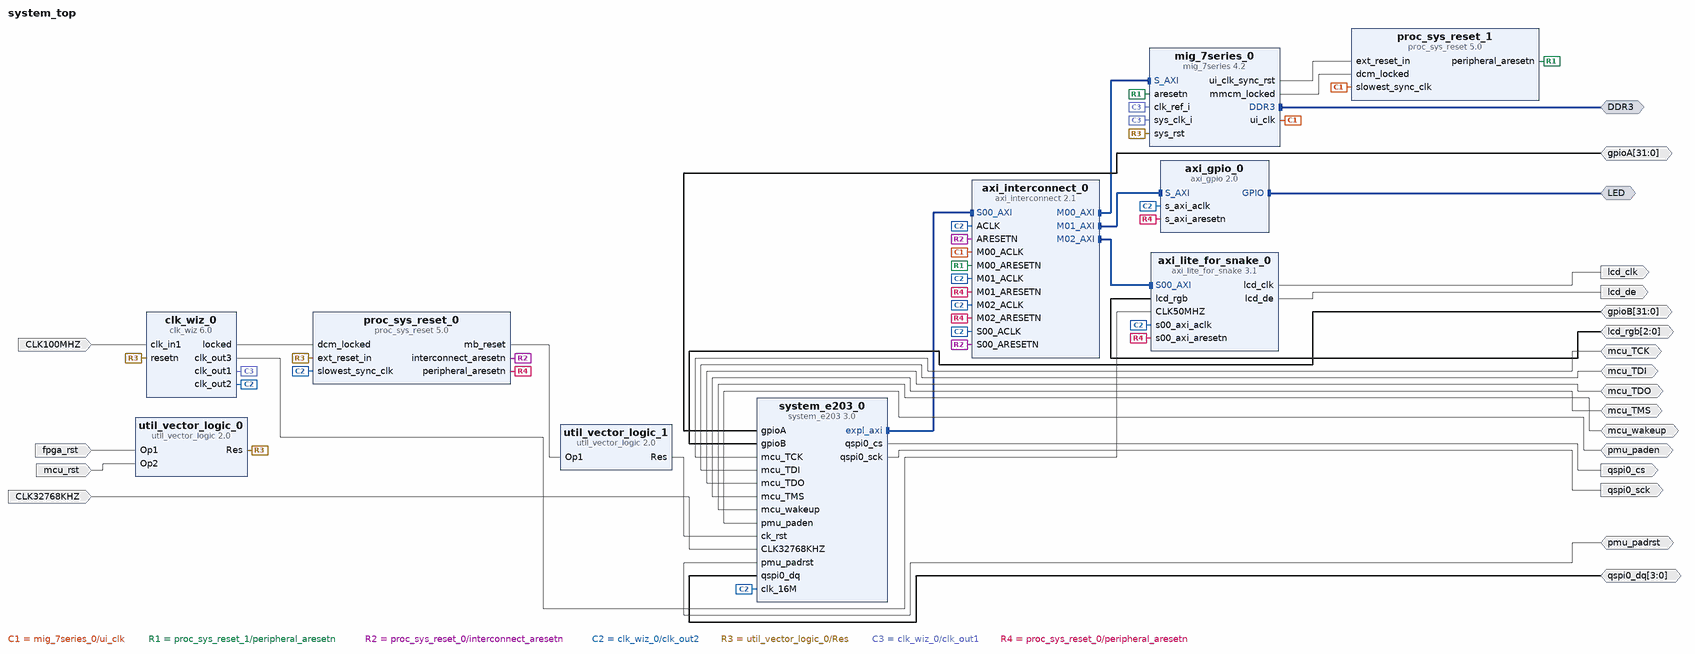
[diagram p0: block diagram of the top level]
# Vivado block design system_top, xc7a200tfbg484-2, Vivado 2020.2
create_bd_design system_top

create_bd_intf_port -mode Master -vlnv xilinx.com:interface:ddrx_rtl:1.0 DDR3
create_bd_intf_port -mode Master -vlnv xilinx.com:interface:gpio_rtl:1.0 LED
create_bd_port -dir I -type clk CLK100MHZ
create_bd_port -dir I -type rst fpga_rst
create_bd_port -dir I CLK32768KHZ
create_bd_port -dir I -type rst mcu_rst
create_bd_port -dir IO -from 31 -to 0 gpioA
create_bd_port -dir IO -from 31 -to 0 gpioB
create_bd_port -dir IO mcu_TCK
create_bd_port -dir IO mcu_TDI
create_bd_port -dir IO mcu_TDO
create_bd_port -dir IO mcu_TMS
create_bd_port -dir IO mcu_wakeup
create_bd_port -dir IO pmu_paden
create_bd_port -dir IO pmu_padrst
create_bd_port -dir O qspi0_cs
create_bd_port -dir IO -from 3 -to 0 qspi0_dq
create_bd_port -dir O qspi0_sck
create_bd_port -dir O lcd_de
create_bd_port -dir IO -from 2 -to 0 lcd_rgb
create_bd_port -dir O -type clk lcd_clk

create_bd_cell -type ip -vlnv xilinx.com:ip:axi_interconnect:2.1 axi_interconnect_0
set_property -dict {CONFIG.ENABLE_ADVANCED_OPTIONS 0 CONFIG.NUM_MI 3} [get_bd_cells axi_interconnect_0]
create_bd_cell -type ip -vlnv xilinx.com:ip:clk_wiz:6.0 clk_wiz_0
set_property -dict [list \
  CONFIG.CLKOUT1_JITTER 126.455 \
  CONFIG.CLKOUT1_PHASE_ERROR 114.212 \
  CONFIG.CLKOUT1_REQUESTED_OUT_FREQ 200.000 \
  CONFIG.CLKOUT2_JITTER 209.277 \
  CONFIG.CLKOUT2_PHASE_ERROR 114.212 \
  CONFIG.CLKOUT2_REQUESTED_OUT_FREQ 16.000 \
  CONFIG.CLKOUT2_USED true \
  CONFIG.CLKOUT3_JITTER 167.017 \
  CONFIG.CLKOUT3_PHASE_ERROR 114.212 \
  CONFIG.CLKOUT3_REQUESTED_OUT_FREQ 50 \
  CONFIG.CLKOUT3_USED true \
  CONFIG.MMCM_CLKFBOUT_MULT_F 8.000 \
  CONFIG.MMCM_CLKOUT0_DIVIDE_F 4.000 \
  CONFIG.MMCM_CLKOUT1_DIVIDE 50 \
  CONFIG.MMCM_CLKOUT2_DIVIDE 16 \
  CONFIG.NUM_OUT_CLKS 3 \
  CONFIG.RESET_PORT resetn \
  CONFIG.RESET_TYPE ACTIVE_LOW \
] [get_bd_cells clk_wiz_0]
create_bd_cell -type ip -vlnv xilinx.com:ip:proc_sys_reset:5.0 proc_sys_reset_1
create_bd_cell -type ip -vlnv xilinx.com:ip:proc_sys_reset:5.0 proc_sys_reset_0
create_bd_cell -type ip -vlnv xilinx.com:ip:util_vector_logic:2.0 util_vector_logic_0
set_property -dict {CONFIG.C_SIZE 1} [get_bd_cells util_vector_logic_0]
create_bd_cell -type ip -vlnv xilinx.com:ip:mig_7series:4.2 mig_7series_0
set_property -dict [list \
  CONFIG.BOARD_MIG_PARAM Custom \
  CONFIG.MIG_DONT_TOUCH_PARAM Custom \
  CONFIG.RESET_BOARD_INTERFACE Custom \
  CONFIG.XML_INPUT_FILE mig_a.prj \
] [get_bd_cells mig_7series_0]
create_bd_cell -type ip -vlnv xilinx.com:ip:util_vector_logic:2.0 util_vector_logic_1
set_property -dict {CONFIG.C_OPERATION not CONFIG.C_SIZE 1} [get_bd_cells util_vector_logic_1]
create_bd_cell -type ip -vlnv xilinx.com:ip:axi_gpio:2.0 axi_gpio_0
set_property -dict {CONFIG.C_ALL_OUTPUTS 1 CONFIG.C_GPIO_WIDTH 2 CONFIG.C_IS_DUAL 0} [get_bd_cells axi_gpio_0]
create_bd_cell -type ip -vlnv xilinx.com:user:system_e203:3.0 system_e203_0
create_bd_cell -type ip -vlnv xilinx.com:user:axi_lite_for_snake:3.1 axi_lite_for_snake_0

# ---- connections ----

connect_bd_intf_net [get_bd_intf_ports DDR3] [get_bd_intf_pins mig_7series_0/DDR3]
connect_bd_intf_net [get_bd_intf_pins axi_interconnect_0/M02_AXI] [get_bd_intf_pins axi_lite_for_snake_0/S00_AXI]
connect_bd_intf_net [get_bd_intf_pins axi_interconnect_0/M01_AXI] [get_bd_intf_pins axi_gpio_0/S_AXI]
connect_bd_intf_net [get_bd_intf_ports LED] [get_bd_intf_pins axi_gpio_0/GPIO]
connect_bd_intf_net [get_bd_intf_pins axi_interconnect_0/M00_AXI] [get_bd_intf_pins mig_7series_0/S_AXI]
connect_bd_intf_net [get_bd_intf_pins system_e203_0/expl_axi] [get_bd_intf_pins axi_interconnect_0/S00_AXI]
connect_bd_net -net clk_in1_0_1 [get_bd_ports CLK100MHZ] [get_bd_pins clk_wiz_0/clk_in1]
connect_bd_net [get_bd_pins mig_7series_0/ui_clk] [get_bd_pins proc_sys_reset_1/slowest_sync_clk] [get_bd_pins axi_interconnect_0/M00_ACLK]
connect_bd_net [get_bd_pins proc_sys_reset_1/peripheral_aresetn] [get_bd_pins axi_interconnect_0/M00_ARESETN] [get_bd_pins mig_7series_0/aresetn]
connect_bd_net [get_bd_pins clk_wiz_0/locked] [get_bd_pins proc_sys_reset_0/dcm_locked]
connect_bd_net [get_bd_pins proc_sys_reset_0/interconnect_aresetn] \
  [get_bd_pins axi_interconnect_0/ARESETN] [get_bd_pins axi_interconnect_0/S00_ARESETN]
connect_bd_net [get_bd_pins clk_wiz_0/clk_out2] \
  [get_bd_pins proc_sys_reset_0/slowest_sync_clk] [get_bd_pins axi_interconnect_0/S00_ACLK] \
  [get_bd_pins axi_interconnect_0/ACLK] [get_bd_pins system_e203_0/clk_16M] [get_bd_pins axi_gpio_0/s_axi_aclk] \
  [get_bd_pins axi_interconnect_0/M01_ACLK] [get_bd_pins axi_interconnect_0/M02_ACLK] \
  [get_bd_pins axi_lite_for_snake_0/s00_axi_aclk]
connect_bd_net [get_bd_ports fpga_rst] [get_bd_pins util_vector_logic_0/Op1]
connect_bd_net [get_bd_ports mcu_rst] [get_bd_pins util_vector_logic_0/Op2]
connect_bd_net [get_bd_pins util_vector_logic_0/Res] \
  [get_bd_pins clk_wiz_0/resetn] [get_bd_pins proc_sys_reset_0/ext_reset_in] [get_bd_pins mig_7series_0/sys_rst]
connect_bd_net [get_bd_ports CLK32768KHZ] [get_bd_pins system_e203_0/CLK32768KHZ]
connect_bd_net [get_bd_ports gpioA] [get_bd_pins system_e203_0/gpioA]
connect_bd_net [get_bd_ports gpioB] [get_bd_pins system_e203_0/gpioB]
connect_bd_net [get_bd_ports mcu_TCK] [get_bd_pins system_e203_0/mcu_TCK]
connect_bd_net [get_bd_ports mcu_TDI] [get_bd_pins system_e203_0/mcu_TDI]
connect_bd_net [get_bd_ports mcu_TDO] [get_bd_pins system_e203_0/mcu_TDO]
connect_bd_net [get_bd_ports mcu_TMS] [get_bd_pins system_e203_0/mcu_TMS]
connect_bd_net [get_bd_ports mcu_wakeup] [get_bd_pins system_e203_0/mcu_wakeup]
connect_bd_net [get_bd_ports pmu_paden] [get_bd_pins system_e203_0/pmu_paden]
connect_bd_net [get_bd_ports pmu_padrst] [get_bd_pins system_e203_0/pmu_padrst]
connect_bd_net [get_bd_pins system_e203_0/qspi0_cs] [get_bd_ports qspi0_cs]
connect_bd_net [get_bd_ports qspi0_dq] [get_bd_pins system_e203_0/qspi0_dq]
connect_bd_net [get_bd_pins system_e203_0/qspi0_sck] [get_bd_ports qspi0_sck]
connect_bd_net [get_bd_pins mig_7series_0/ui_clk_sync_rst] [get_bd_pins proc_sys_reset_1/ext_reset_in]
connect_bd_net [get_bd_pins mig_7series_0/mmcm_locked] [get_bd_pins proc_sys_reset_1/dcm_locked]
connect_bd_net [get_bd_pins clk_wiz_0/clk_out1] [get_bd_pins mig_7series_0/clk_ref_i] [get_bd_pins mig_7series_0/sys_clk_i]
connect_bd_net [get_bd_pins proc_sys_reset_0/mb_reset] [get_bd_pins util_vector_logic_1/Op1]
connect_bd_net [get_bd_pins util_vector_logic_1/Res] [get_bd_pins system_e203_0/ck_rst]
connect_bd_net -net M01_ARESETN_1 [get_bd_pins proc_sys_reset_0/peripheral_aresetn] \
  [get_bd_pins axi_interconnect_0/M01_ARESETN] [get_bd_pins axi_gpio_0/s_axi_aresetn] \
  [get_bd_pins axi_interconnect_0/M02_ARESETN] [get_bd_pins axi_lite_for_snake_0/s00_axi_aresetn]
connect_bd_net [get_bd_pins axi_lite_for_snake_0/lcd_de] [get_bd_ports lcd_de]
connect_bd_net [get_bd_pins axi_lite_for_snake_0/lcd_clk] [get_bd_ports lcd_clk]
connect_bd_net [get_bd_ports lcd_rgb] [get_bd_pins axi_lite_for_snake_0/lcd_rgb]
connect_bd_net [get_bd_pins clk_wiz_0/clk_out3] [get_bd_pins axi_lite_for_snake_0/CLK50MHZ]

# ---- address map ----
assign_bd_address -offset 0x40000000 -range 64K -target_address_space [get_bd_addr_spaces system_e203_0/expl_axi] [get_bd_addr_segs axi_gpio_0/S_AXI/Reg]
assign_bd_address -offset 0x40010000 -range 64K -target_address_space [get_bd_addr_spaces system_e203_0/expl_axi] [get_bd_addr_segs axi_lite_for_snake_0/S00_AXI/S00_AXI_reg]
assign_bd_address -offset 0x60000000 -range 512M -target_address_space [get_bd_addr_spaces system_e203_0/expl_axi] [get_bd_addr_segs mig_7series_0/memmap/memaddr]

validate_bd_design
save_bd_design
